# Altium schematic sheet Master_Board_v1_110116.SchDoc
size A2
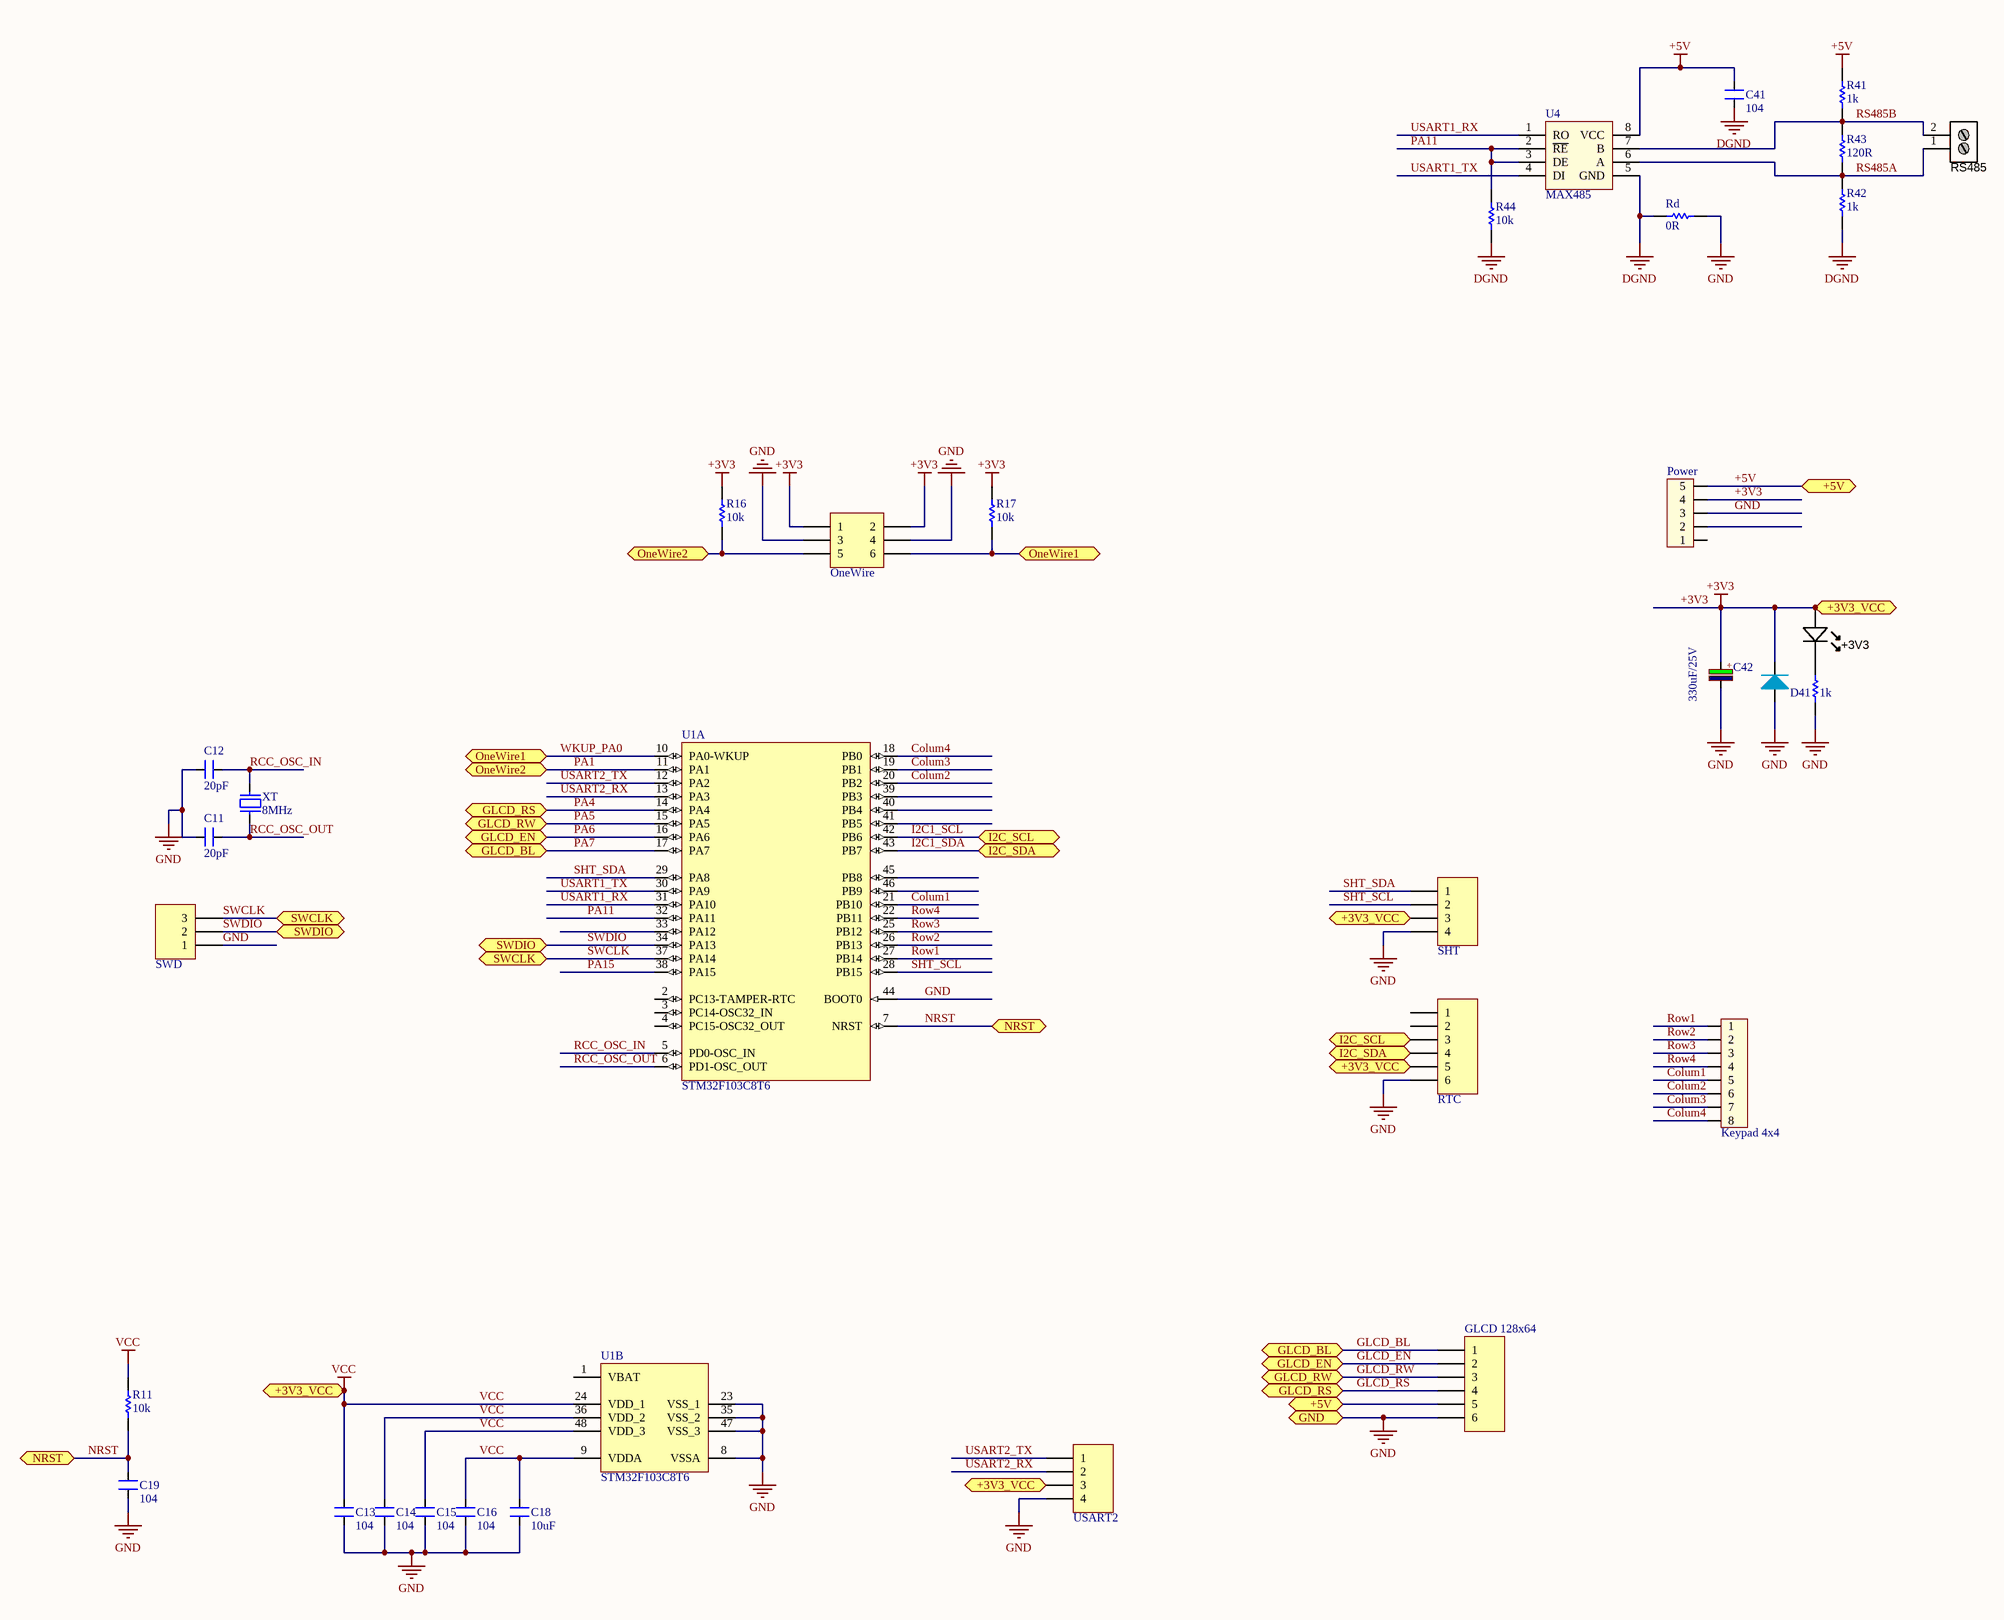
[diagram p0: Master_Board_v1_110116.SchDoc]

## Parts
+3V3  Blue  [LED-0805-K]  (value not drawn)
C11  value 20pF  [CAPC1608N]  (hidden comment: Cap_22p_0603)
C12  value 20pF  [CAPC1608N]  (hidden comment: Cap_22p_0603)
C13  value 104  [CAPC1608N]  (hidden comment: Cap_104_0603)
C14  value 104  [CAPC1608N]  (hidden comment: Cap_104_0603)
C15  value 104  [CAPC1608N]  (hidden comment: Cap_104_0603)
C16  value 104  [CAPC1608N]  (hidden comment: Cap_104_0603)
C18  value 10uF  [CAPC2012N_F]  (hidden comment: Cap_10uF_0805)
C19  value 104  [CAPC1608N]  (hidden comment: Cap_104_0603)
C41  value 104  [CAPC2012N_F]  (hidden comment: 100nF/104)
C42  330uF/25V  [CAPMP3528X210N]
D41  Diode  [DO-214AC]  (value not drawn)
GLCD_128x64  Header 6  [HDR1X6]  (value not drawn)
Keypad_4x4  JP8  [CON8]  (value not drawn)
OneWire  Header 3X2  [HDR2X3]  (value not drawn)
Power  JP5  [CON5]  (value not drawn)
R11  value 10k  [RESC1608N_F]  (hidden comment: Res_10k_0603)
R16  value 10k  [RESC2012N_F]  (hidden comment: Res)
R17  value 10k  [RESC2012N_F]  (hidden comment: Res)
R41  1k  [RESC2012N_F]
R42  1k  [RESC2012N_F]
R43  value 120R  [RESC2012N_F]  (hidden comment: 330R)
R44  value 10k  [RESC2012N_F]  (hidden comment: 330R)
Rd  value 0R  [RESC2012N_F]  (hidden comment: Res)
Rled  value 1k  [RESC2012N_F]  (hidden comment: Res_0805_1k)
RS485  Stackable ScrewTerm  [2P_PCB1]  (value not drawn)
RTC  Header 6  [HDR1X6]  (value not drawn)
SHT  Header 4  [HDR1X4]  (value not drawn)
SWD  Header 3  [HDR1X3]  (value not drawn)
U1  STM32F103C8T6  [LQFT48N]  (parts A,B of 2)
U4  MAX485  [SO-8]
USART2  Header 4  [HDR1X4]  (value not drawn)
XT  8MHz  [XT2]

## Ports
+3V3_VCC, +5V, GLCD_BL, GLCD_EN, GLCD_RS, GLCD_RW, GND, I2C_SCL, I2C_SDA, NRST, OneWire1, OneWire2, SWCLK, SWDIO

## Nets
+3V3: +3V3.A C13.2 C14.2 C15.2 C16.2 C18.2 C42.1 D41.2(K) OneWire.1 OneWire.2 Power.4 R11.2 R16.2 R17.2 RTC.5 SHT.3 U1.9(VDDA) U1.24(VDD_1) U1.36(VDD_2) U1.48(VDD_3) USART2.3 ; port +3V3_VCC  [also labelled VCC]
+5V: C41.2 GLCD_128x64.5 Power.5 R41.2 U4.8(VCC) ; port +5V
DGND: C41.1 R42.1 R44.1 Rd.1 U4.5(GND)
GND: C11.2 C12.2 C13.1 C14.1 C15.1 C16.1 C18.1 C19.1 C42.2 D41.1(A) GLCD_128x64.6 OneWire.3 OneWire.4 Power.3 Rd.2 Rled.2 RTC.6 SHT.4 SWD.1 U1.8(VSSA) U1.23(VSS_1) U1.35(VSS_2) U1.44(BOOT0) U1.47(VSS_3) USART2.4 ; port GND
Colum1: Keypad_4x4.5 U1.21(PB10)
Colum2: Keypad_4x4.6 U1.20(PB2)
Colum3: Keypad_4x4.7 U1.19(PB1)
Colum4: Keypad_4x4.8 U1.18(PB0)
GLCD_BL: GLCD_128x64.1 U1.17(PA7) ; port GLCD_BL  [also labelled PA7]
GLCD_EN: GLCD_128x64.2 U1.16(PA6) ; port GLCD_EN  [also labelled PA6]
GLCD_RS: GLCD_128x64.4 U1.14(PA4) ; port GLCD_RS  [also labelled PA4]
GLCD_RW: GLCD_128x64.3 U1.15(PA5) ; port GLCD_RW  [also labelled PA5]
I2C1_SCL: RTC.3 U1.42(PB6) ; port I2C_SCL
I2C1_SDA: RTC.4 U1.43(PB7) ; port I2C_SDA
NRST: C19.2 R11.1 U1.7(NRST) ; port NRST
PA1: OneWire.5 R16.1 U1.11(PA1) ; port OneWire2
PA11: R44.2 U1.32(PA11) U4.2(~{RE}) U4.3(DE)
PA15: U1.38(PA15)
RCC_OSC_IN: C12.1 U1.5(PD0-OSC_IN) XT.2
RCC_OSC_OUT: C11.1 U1.6(PD1-OSC_OUT) XT.1
Row1: Keypad_4x4.1 U1.27(PB14)
Row2: Keypad_4x4.2 U1.26(PB13)
Row3: Keypad_4x4.3 U1.25(PB12)
Row4: Keypad_4x4.4 U1.22(PB11)
RS485A: R42.2 R43.1 RS485.1 U4.6(A)
RS485B: R41.1 R43.2 RS485.2 U4.7(B)
SHT_SCL: SHT.2 U1.28(PB15)
SHT_SDA: SHT.1 U1.29(PA8)
SWCLK: SWD.3 U1.37(PA14) ; port SWCLK
SWDIO: SWD.2 U1.34(PA13) ; port SWDIO
USART1_RX: U1.31(PA10) U4.1(RO)
USART1_TX: U1.30(PA9) U4.4(DI)
USART2_RX: U1.13(PA3) USART2.2
USART2_TX: U1.12(PA2) USART2.1
WKUP_PA0: OneWire.6 R17.1 U1.10(PA0-WKUP) ; port OneWire1
Net+3V3_K: +3V3.K Rled.1

Not connected (* = marked no-connect by the designer): Power 1 2; RTC 1 2; U1 1(VBAT) 2(PC13-TAMPER-RTC) 3(PC14-OSC32_IN) 4(PC15-OSC32_OUT) 33(PA12) 39(PB3) 40(PB4) 41(PB5) 45(PB8) 46(PB9)

## Notes on the sheet
- (in symbol CP4) +

## Library data of the parts
+3V3 = LED_SMD_Blue_0805_100mcd: LED 0805 SMD Blue 100mcd 470nm; Manufacturer 1: Ligitek; Manufacturer Part Number 1: LG-170DBKZ-CT; Ratings: 100 mcd; 470 nm; Package / Case: 0805; Material: InGaN/GaN; Value: Blue; Color: Blue
C11-C16 C18 C19 C41 = CAP NP
C42 = CP4: Cap 1000uF/16V - 220uF/50V; Description 5: 4,7uF>10uF/250V_3,3uF>10uF/400V - 2,2uF>4,7uF/450V; Description 1: 2200uF-3300uF/6,3V - 1000uF-2200uF/10V; Description 2: 1000uF/16V - 470uF => 1000uF/25V - 100uF/100V; Description 3: 330uF>470uF/35V_220uF>470uF/50V_10uF>22uF/250V; Description 4: 220uF => 330uF/63V - 10uF =>33uF/160 - 200V; Value: 1000uF/16V
D41 = Diode: pin to pad: 1>A 2>K
GLCD_128x64 RTC = Header 6: Header, 6-Pin; LatestRevisionDate: 17-Jul-2002; LatestRevisionNote: Re-released for DXP Platform.; Publisher: Altium Limited
Keypad_4x4 = Con8: Connector 8; Value: Connector 8
OneWire = Header 3X2: Header, 3-Pin, Dual row; LatestRevisionDate: 17-Jul-2002; LatestRevisionNote: Re-released for DXP Platform.; Publisher: Altium Limited
Power = Con5: Connector 5; Value: Connector 5
R11 Rled = Res
R41-R44 = Res: Tro dan
  R41 R42: Value: 1k
RS485 = 2P_ScrewTerm_90S_3.81MM: Terminal Block Screw Type THT 2-Position 3.81mm pitch; Manufacturer 1: Tyco Electronics; Manufacturer Part Number 1: 1776113-2; Value: 2 position; Pitch: 0.150" (3.81mm); Positions Per Level: 2; Package / Case: Side Entry; 3.81mm pitch; Category: Connectors Interconnects; Color: Black; Supplier 1: Digi-Key; Supplier Part Number 1: A97976-ND
SHT USART2 = Header 4: Header, 4-Pin; LatestRevisionDate: 17-Jul-2002; LatestRevisionNote: Re-released for DXP Platform.; Publisher: Altium Limited
SWD = Header 3: Header, 3-Pin; LatestRevisionDate: 17-Jul-2002; LatestRevisionNote: Re-released for DXP Platform.; Publisher: Altium Limited
U1 = STM32F103C8T6: ARM Cortex-M3 32-bit MCU, 64 KB Flash, 20 KB Internal RAM, 37 I/Os, 48-pin LQFP, -40 to 85 degC, Tray; A/D Converter: 2x12-bit (10 Channel); FLASH Size (Prog) (kB): 64; I/Os (High Current): 37; Internal RAM Size (kB): 20; Operating Frequency(F) (Processor speed) (MHz): 72; Supply Voltage(Vcc) min (V): 2; DatasheetVersion: Rev. 16; PackageVersion: Rev. 6, 06/2013; PackageReference: LQFP48; PackageDescription: 48-Pin Low Profile Quad Flat Package, 7 x 7 mm Body, 0.5 mm Pitch; Supplier 1: Digi-Key; Supplier Part Number 1: 497-6063-ND; Supplier 2: Farnell; Supplier Part Number 2: 1447637; Supplier 3: Newark; Supplier Part Number 3: 59M2182; Supplier 4: Newark; Supplier Part Number 4: 57P1222; Supplier 5: Mouser; Supplier Part Number 5: 511-STM32F103C8T6; Core: ARM Cortex-M3; Packing: Tray; Mounting Technology: Surface Mount; PartNumber: STM32F103C8T6; ComponentLink1Description: Manufacturer URL; ComponentLink1URL: http://www.st.com/web/en/home.html; ComponentLink2Description: Datasheet; ComponentLink2URL: http://www.st.com/st-web-ui/static/active/en/resource/technical/document/datasheet/CD00161566.pdf; ComponentLink3Description: Package Specification; ComponentLink3URL: http://www.st.com/st-web-ui/static/active/en/resource/technical/document/datasheet/DM00058181.pdf
U4 = MAX485: RS232 - RS485 (Same sn75176)
XT = Crystal